# EAGLE design pc-gen-breadboard (EAGLE 6.4)
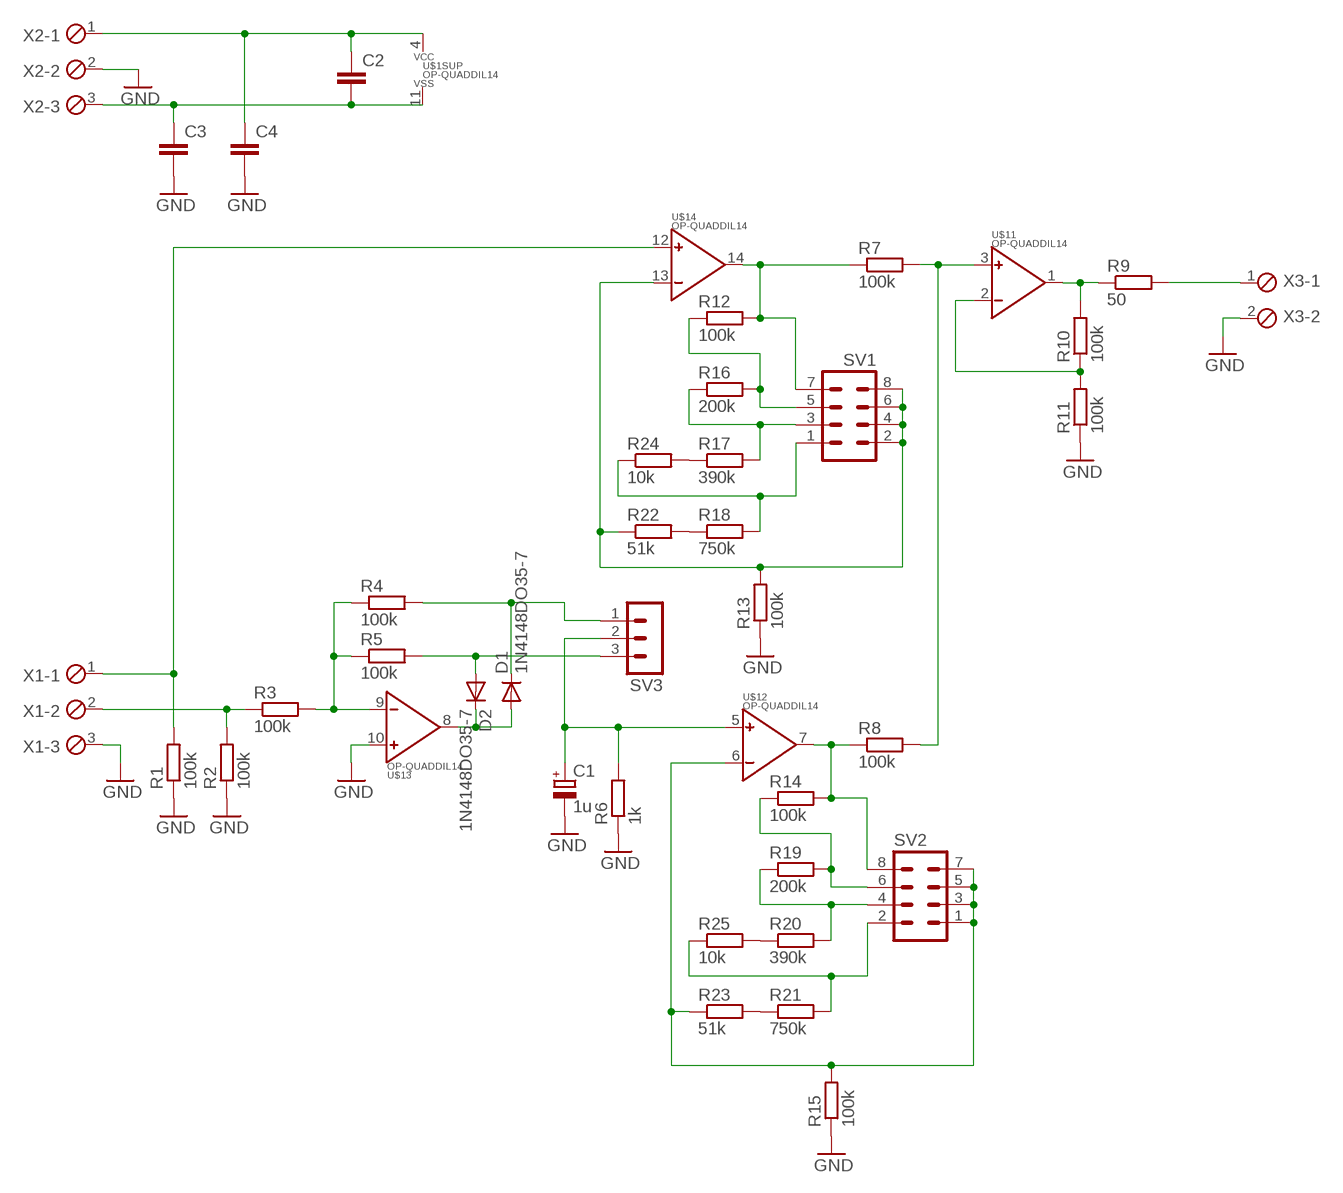
[diagram p0: schematic, sheet 1]

## Parts
C1  1u  CPOL-EUE2.5-7  [E2,5-7]
C2  C-EU050-025X075  [C050-025X075]
C3  C-EU050-025X075  [C050-025X075]
C4  C-EU050-025X075  [C050-025X075]
D1  1N4148DO35-7  [DO35-7]
D2  1N4148DO35-7  [DO35-7]
R1  100k  R-EU_0207/2V  [0207/2V]
R2  100k  R-EU_0207/2V  [0207/2V]
R3  100k  R-EU_0207/7  [0207/7]
R4  100k  R-EU_0207/2V  [0207/2V]
R5  100k  R-EU_0207/2V  [0207/2V]
R6  1k  R-EU_0207/2V  [0207/2V]
R7  100k  R-EU_0207/7  [0207/7]
R8  100k  R-EU_0207/7  [0207/7]
R9  50  R-EU_0207/7  [0207/7]
R10  100k  R-EU_0207/2V  [0207/2V]
R11  100k  R-EU_0207/7  [0207/7]
R12  100k  R-EU_0207/2V  [0207/2V]
R13  100k  R-EU_0207/7  [0207/7]
R14  100k  R-EU_0207/2V  [0207/2V]
R15  100k  R-EU_0207/2V  [0207/2V]
R16  200k  R-EU_0207/2V  [0207/2V]
R17  390k  R-EU_0207/2V  [0207/2V]
R18  750k  R-EU_0207/2V  [0207/2V]
R19  200k  R-EU_0207/2V  [0207/2V]
R20  390k  R-EU_0207/2V  [0207/2V]
R21  750k  R-EU_0207/2V  [0207/2V]
R22  51k  R-EU_0207/2V  [0207/2V]
R23  51k  R-EU_0207/2V  [0207/2V]
R24  10k  R-EU_0207/2V  [0207/2V]
R25  10k  R-EU_0207/2V  [0207/2V]
SV1  MA04-2  [MA04-2]
SV2  MA04-2  [MA04-2]
SV3  MA03-1  [MA03-1]
U$1  OP-QUADDIL14  [DIL14]
X1  MPT3  [3POL254]
X2  MPT3  [3POL254]
X3  MPT2  [2POL254]

## Nets
GND: C1.- C3.2 C4.2 R1.1 R2.1 R6.1 R11.1 R13.1 R15.1 U$1.10(3:POS) X1.3 X2.2 X3.2
N$1: C2.2 C3.1 U$1.11(SUP:VSS) X2.3
N$2: C2.1 C4.1 U$1.4(SUP:VCC) X2.1
N$3: R2.2 R3.1 X1.2
N$4: R1.2 U$1.12(4:POS) X1.1
N$5: R21.2 R25.1 SV2.2
N$6: R3.2 R4.1 R5.1 U$1.9(3:NEG)
N$7: D2.A R5.2 SV3.3
N$8: R7.1 R12.2 SV1.7 U$1.14(4:OUT)
N$9: D1.A D2.C U$1.8(3:OUT)
N$10: R15.2 R23.1 SV2.1 SV2.3 SV2.5 SV2.7 U$1.6(2:NEG)
N$11: D1.C R4.2 SV3.1
N$12: R8.1 R14.2 SV2.8 U$1.7(2:OUT)
N$13: R7.2 R8.2 U$1.3(1:POS)
N$14: R9.2 X3.1
N$15: R9.1 R10.2 U$1.1(1:OUT)
N$16: R10.1 R11.2 U$1.2(1:NEG)
N$17: R12.1 R16.2 SV1.5
N$18: R16.1 R17.2 SV1.3
N$19: R18.2 R24.1 SV1.1
N$20: R14.1 R19.2 SV2.6
N$21: R18.1 R22.2
N$22: R13.2 R22.1 SV1.2 SV1.4 SV1.6 SV1.8 U$1.13(4:NEG)
N$23: R19.1 R20.2 SV2.4
N$24: R17.1 R24.2
N$25: R21.1 R23.2
N$26: R20.1 R25.2
N$27: C1.+ R6.2 SV3.2 U$1.5(2:POS)

## Library data of the parts
C1 = rcl:CPOL-EU: POLARIZED CAPACITOR, European symbol
C2-C4 = rcl:C-EU: CAPACITOR, European symbol
D1 D2 = diode:1N4148: DIODE high speed (Philips)
R1-R25 = rcl:R-EU_: RESISTOR, European symbol
SV1 SV2 = con-lstb:MA04-2: PIN HEADER; OC_FARNELL: unknown; OC_NEWARK: unknown
SV3 = con-lstb:MA03-1: PIN HEADER; OC_FARNELL: unknown; OC_NEWARK: unknown
U$1 = pc-gen:OP-QUAD
X1 X2 = con-phoenix-254:MPT3: PHOENIX CONNECTOR; OC_FARNELL: unknown; OC_NEWARK: unknown
X3 = con-phoenix-254:MPT2: PHOENIX CONNECTOR; OC_FARNELL: unknown; OC_NEWARK: unknown

## Board
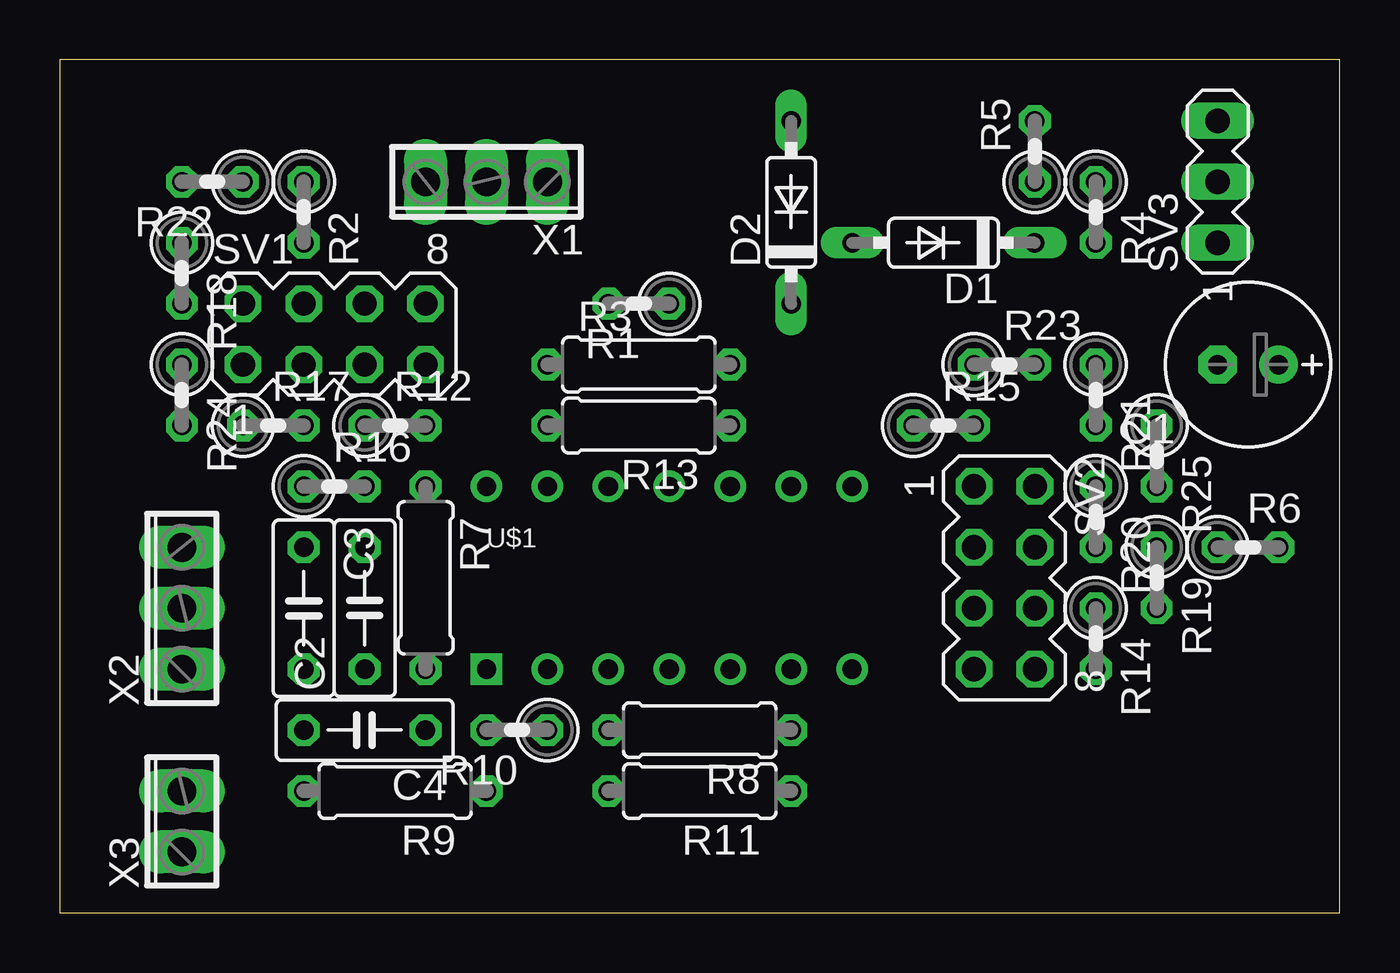
[diagram p1: board, top side]
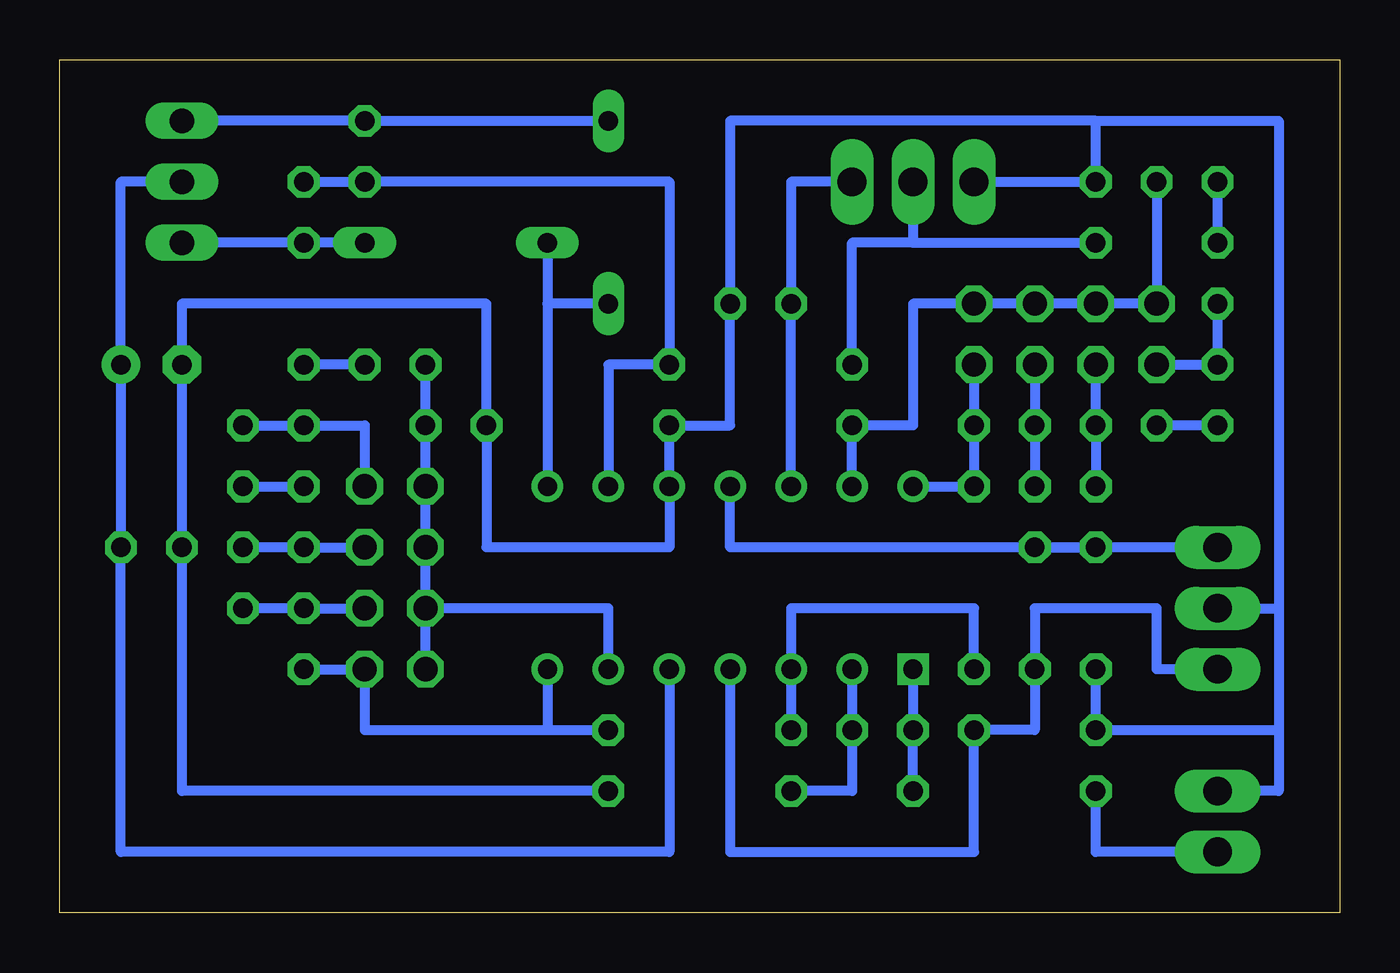
[diagram p2: board, bottom side, seen from below]

Size 53.34 x 35.56 mm. Coordinates in mm from the lower left corner, seen from the top.
Outline: 0,0 53.34,0 53.34,35.56 0,35.56 0,0
Copper layers (1*16): Top 0.035mm / dielectric 1.5mm / Bottom 0.035mm
Design rules "default *": minimum track width 10mil, minimum drill 24mil, track to track 8mil, track to pad 8mil, pad to pad 8mil, via to via 8mil, smd to smd 8mil, copper to edge 40mil, drill to drill 8mil, minimum pad ring 10mil, minimum via ring 8mil, stop-mask expansion 4mil, vias tented up to drill 0mil, thermal gap 10mil

### Footprints (pad centres in the part's own frame; a part is rotated, then mirrored left to right if it is on the bottom)
E2,5-7 = drill 0.813 pad 1.6: + -1.27,0 | drill 0.813 pad 1.6 octagon: - 1.27,0
C050-025X075 = drill 0.813 octagon: 1 -2.54,0; 2 2.54,0
DO35-7 = drill 0.813 long: A 3.81,0; C -3.81,0
0207/2V = drill 0.813 octagon: 1 -1.27,0; 2 1.27,0
0207/7 = drill 0.813 octagon: 1 -3.81,0; 2 3.81,0
MA04-2 = drill 1.016 octagon: 1 -3.81,-1.27; 2 -3.81,1.27; 3 -1.27,-1.27; 4 -1.27,1.27; 5 1.27,-1.27; 6 1.27,1.27; 7 3.81,-1.27; 8 3.81,1.27
MA03-1 = drill 1.016 long: 1 -2.54,0; 2 0,0; 3 2.54,0
DIL14 = drill 0.8 square: 1 -7.62,-3.81 | drill 0.8: 2 -5.08,-3.81; 3 -2.54,-3.81; 4 0,-3.81; 5 2.54,-3.81; 6 5.08,-3.81; 7 7.62,-3.81; 8 7.62,3.81; 9 5.08,3.81; 10 2.54,3.81; 11 0,3.81; 12 -2.54,3.81; 13 -5.08,3.81; 14 -7.62,3.81
3POL254 = drill 1.2 long: 1 -2.54,0; 2 0,0; 3 2.54,0
2POL254 = drill 1.2 long: 1 -1.27,0; 2 1.27,0

### Placement (x,y rotation side)
C1  49.53,22.86 180 top
C2  12.7,12.7 90 top
C3  10.16,12.7 270 top
C4  12.7,7.62 180 top
D1  36.83,27.94 180 top
D2  30.48,29.21 90 top
R1  24.13,25.4 180 top
R2  10.16,29.21 270 top
R3  24.13,22.86 0 top
R4  43.18,29.21 270 top
R5  40.64,31.75 90 top
R6  49.53,15.24 0 top
R7  15.24,13.97 270 top
R8  26.67,7.62 180 top
R9  13.97,5.08 180 top
R10  19.05,7.62 180 top
R11  26.67,5.08 180 top
R12  13.97,20.32 0 top
R13  24.13,20.32 180 top
R14  43.18,11.43 270 top
R15  36.83,20.32 0 top
R16  11.43,17.78 0 top
R17  8.89,20.32 0 top
R18  5.08,26.67 270 top
R19  45.72,13.97 270 top
R20  43.18,16.51 270 top
R21  43.18,21.59 270 top
R22  6.35,30.48 180 top
R23  39.37,22.86 0 top
R24  5.08,21.59 270 top
R25  45.72,19.05 270 top
SV1  11.43,24.13 0 top
SV2  39.37,13.97 270 top
SV3  48.26,30.48 90 top
U$1  25.4,13.97 0 top
X1  17.78,30.48 180 top
X2  5.08,12.7 90 top
X3  5.08,3.81 90 top

### Tracks (layer width: path | path; a pad name or v marks a point on that pad's centre or on a via)
GND
  Bottom 0.406: X2.2 2.54,12.7 | 2.54,12.7 2.54,7.62 | 2.54,7.62 2.54,5.08 X3.2 | R11.1 48.26,5.08 R6.1 C1.- 48.26,25.4 35.56,25.4 R15.1 35.56,15.24 27.94,15.24 U$1.10 R13.1 25.4,20.32 R1.1 25.4,33.02 10.16,33.02 | 2.54,7.62 C4.2 C3.2 | X1.3 R2.1 10.16,33.02 | 10.16,33.02 2.54,33.02 2.54,12.7
N$1
  Bottom 0.406: U$1.11 25.4,15.24 C3.1 C2.2 X2.3
N$2
  Bottom 0.406: U$1.4 25.4,2.54 15.24,2.54 C4.1 12.7,7.62 C2.1 12.7,12.7 7.62,12.7 7.62,10.16 X2.1
N$3
  Bottom 0.406: X1.2 17.78,27.94 | 17.78,27.94 20.32,27.94 R3.1 | 17.78,27.94 R2.2
N$4
  Bottom 0.406: U$1.12 R1.2 22.86,30.48 X1.1
N$5
  Bottom 0.406: SV2.2 40.64,20.32 R21.2 R25.1
N$6
  Bottom 0.406: U$1.9 30.48,22.86 R3.2 27.94,30.48 R5.1 R4.1
N$7
  Bottom 0.406: SV3.3 R5.2 D2.A
N$8
  Bottom 0.406: U$1.14 R7.1 R12.2 SV1.7
N$9
  Bottom 0.406: D1.A 33.02,25.4 | 33.02,25.4 U$1.8 | D2.C 33.02,25.4
N$10
  Bottom 0.406: U$1.6 30.48,12.7 SV2.5 | SV2.7 SV2.5 | SV2.5 SV2.3 SV2.1 R15.2 R23.1
N$11
  Bottom 0.406: SV3.1 R4.2 D1.C
N$12
  Bottom 0.406: U$1.7 33.02,7.62 | 33.02,7.62 R8.1 | R14.2 SV2.8 40.64,7.62 33.02,7.62
N$13
  Bottom 0.406: R7.2 15.24,12.7 22.86,12.7 U$1.3 R8.2
N$14
  Bottom 0.406: X3.1 10.16,2.54 R9.2
N$15
  Bottom 0.406: U$1.1 R10.2 R9.1
N$16
  Bottom 0.406: U$1.2 R10.1 20.32,5.08 R11.2
N$17
  Bottom 0.406: SV1.5 R12.1 R16.2
N$18
  Bottom 0.406: R16.1 R17.2 SV1.3
N$19
  Bottom 0.406: SV1.1 R24.1 R18.2
N$20
  Bottom 0.406: R19.2 R14.1 SV2.6
N$21
  Bottom 0.406: R18.1 R22.2
N$22
  Bottom 0.406: U$1.13 R13.2 17.78,20.32 17.78,25.4 SV1.8 SV1.6 SV1.4 SV1.2 R22.1
N$23
  Bottom 0.406: R19.1 R20.2 SV2.4
N$24
  Bottom 0.406: R24.2 R17.1
N$25
  Bottom 0.406: R23.2 R21.1
N$26
  Bottom 0.406: R25.2 R20.1
N$27
  Bottom 0.406: U$1.5 27.94,2.54 50.8,2.54 R6.2 C1.+ 50.8,30.48 SV3.2

### Text on the board
Reference: In | GND | Offset | Signal | - | Polarity | + | +8V | GND | Supply | -8V | GND | Out | Signal